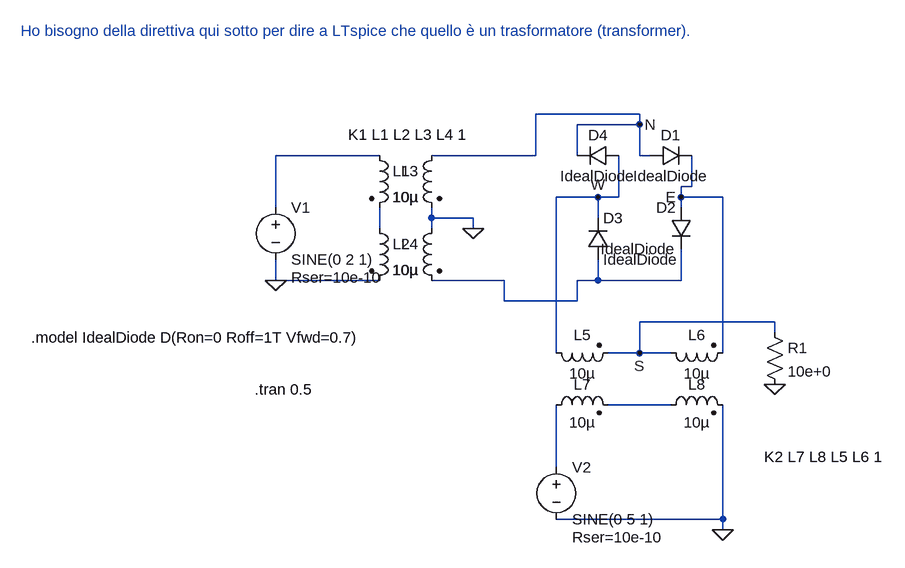
[diagram p0: schematic diode_bridge_precision_rectifier.asc]
diode_bridge_precision_rectifier.asc, the LTspice schematic file:
Version 4
SHEET 1 916 680
WIRE 528 -16 368 -16
WIRE 528 0 528 -16
WIRE 528 0 432 0
WIRE 128 48 -32 48
WIRE 368 48 368 -16
WIRE 368 48 208 48
WIRE 432 48 432 0
WIRE 528 48 528 0
WIRE 544 48 528 48
WIRE 608 96 608 48
WIRE 608 96 592 96
WIRE 464 112 400 112
WIRE 496 112 496 48
WIRE 496 112 464 112
WIRE 592 112 592 96
WIRE 656 112 592 112
WIRE -32 128 -32 48
WIRE 592 128 592 112
WIRE 208 144 208 128
WIRE 272 144 208 144
WIRE 464 144 464 112
WIRE 128 160 128 128
WIRE 208 160 208 144
WIRE 272 160 272 144
WIRE -32 240 -32 208
WIRE 128 240 -32 240
WIRE 320 240 208 240
WIRE 464 240 464 208
WIRE 464 240 432 240
WIRE 592 240 592 192
WIRE 592 240 464 240
WIRE 320 272 320 240
WIRE 432 272 432 240
WIRE 432 272 320 272
WIRE 736 304 528 304
WIRE 736 320 736 304
WIRE 400 352 400 112
WIRE 528 352 528 304
WIRE 528 352 480 352
WIRE 576 352 528 352
WIRE 656 352 656 112
WIRE 576 432 480 432
WIRE 400 528 400 432
WIRE 656 608 656 432
WIRE 656 608 400 608
WIRE 656 624 656 608
FLAG 272 160 0
FLAG -32 240 0
FLAG 736 400 0
FLAG 656 624 0
FLAG 528 0 N
FLAG 592 112 E
FLAG 464 112 W
FLAG 528 352 S
SYMBOL voltage -32 112 R0
WINDOW 123 0 0 Left 0
WINDOW 39 24 124 Left 2
SYMATTR SpiceLine Rser=10e-10
SYMATTR InstName V1
SYMATTR Value SINE(0 2 1)
SYMBOL ind2 112 32 R0
SYMATTR InstName L1
SYMATTR Value 10µ
SYMATTR Type ind
SYMBOL ind2 112 144 R0
SYMATTR InstName L2
SYMATTR Value 10µ
SYMATTR Type ind
SYMBOL ind2 224 32 M0
SYMATTR InstName L3
SYMATTR Value 10µ
SYMATTR Type ind
SYMBOL ind2 224 144 M0
SYMATTR InstName L4
SYMATTR Value 10µ
SYMATTR Type ind
SYMBOL diode 544 32 M90
WINDOW 0 0 32 VBottom 2
WINDOW 3 32 32 VTop 2
SYMATTR InstName D1
SYMATTR Value IdealDiode
SYMBOL diode 608 128 M0
SYMATTR InstName D2
SYMATTR Value IdealDiode
SYMBOL diode 448 208 M180
WINDOW 0 24 64 Left 2
WINDOW 3 24 0 Left 2
SYMATTR InstName D3
SYMATTR Value IdealDiode
SYMBOL diode 496 64 M270
WINDOW 0 32 32 VTop 2
WINDOW 3 0 32 VBottom 2
SYMATTR InstName D4
SYMATTR Value IdealDiode
SYMBOL ind2 384 336 M90
WINDOW 0 4 56 VBottom 2
WINDOW 3 32 56 VTop 2
SYMATTR InstName L5
SYMATTR Value 10µ
SYMATTR Type ind
SYMBOL ind2 560 336 M90
WINDOW 0 4 56 VBottom 2
WINDOW 3 32 56 VTop 2
SYMATTR InstName L6
SYMATTR Value 10µ
SYMATTR Type ind
SYMBOL ind2 384 448 R270
WINDOW 0 32 56 VTop 2
WINDOW 3 5 56 VBottom 2
SYMATTR InstName L7
SYMATTR Value 10µ
SYMATTR Type ind
SYMBOL ind2 560 448 R270
WINDOW 0 32 56 VTop 2
WINDOW 3 5 56 VBottom 2
SYMATTR InstName L8
SYMATTR Value 10µ
SYMATTR Type ind
SYMBOL res 720 304 R0
SYMATTR InstName R1
SYMATTR Value 10e+0
SYMBOL voltage 400 512 R0
WINDOW 123 0 0 Left 0
WINDOW 39 24 124 Left 2
SYMATTR SpiceLine Rser=10e-10
SYMATTR InstName V2
SYMATTR Value SINE(0 5 1)
TEXT -64 408 Left 2 !.tran 0.5
TEXT -408 328 Left 2 !.model IdealDiode D(Ron=0 Roff=1T Vfwd=0.7)
TEXT 80 16 Left 2 !K1 L1 L2 L3 L4 1
TEXT -424 -144 Left 2 ;Ho bisogno della direttiva qui sotto per dire a LTspice che quello è un trasformatore (transformer).
TEXT 720 512 Left 2 !K2 L7 L8 L5 L6 1

The netlist it stands for:
* diode_bridge_precision_rectifier.asc
V1 N001 0 SINE(0 2 1) Rser=10e-10
L1 N001 N002 10µ
L2 N002 0 10µ
L3 N 0 10µ
L4 0 N003 10µ
D1 N E IdealDiode
D2 E N003 IdealDiode
D3 N003 W IdealDiode
D4 W N IdealDiode
L5 W S 10µ
L6 S E 10µ
L7 N005 N004 10µ
L8 N004 0 10µ
R1 S 0 10e+0
V2 N005 0 SINE(0 5 1) Rser=10e-10
.model D D
.lib standard.dio
.tran 0.5
.model IdealDiode D(Ron=0 Roff=1T Vfwd=0.7)
K1 L1 L2 L3 L4 1
* Ho bisogno della direttiva qui sotto per dire a LTspice che quello è un trasformatore (transformer).
K2 L7 L8 L5 L6 1
.backanno
.end